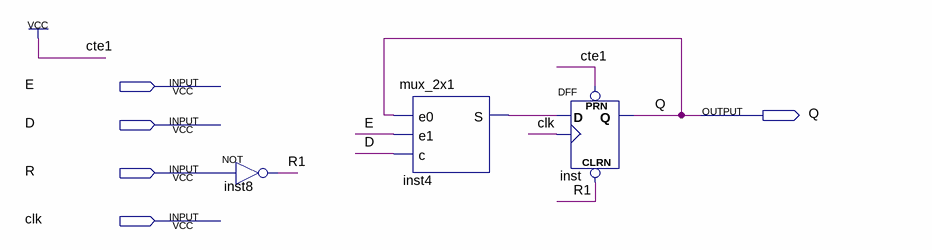
[diagram p0: schematic sheet]
// Quartus schematic registrador.bdf as structural Verilog: 3 symbols, 5 pins
module registrador (
  input  E,
  input  D,
  input  R,
  input  clk,
  output Q
);

  wire inst4_s, R1;

  not inst8 (R1, R);
  mux_2x1 inst4 (.e0(Q), .e1(E), .c(D), .S(inst4_s));
  DFF inst (.CLRN(R1), .CLK(clk), .D(inst4_s), .PRN(1'b1), .Q(Q));
endmodule
